# EAGLE schematic Schematic_v3_2 (EAGLE 9.6.2)
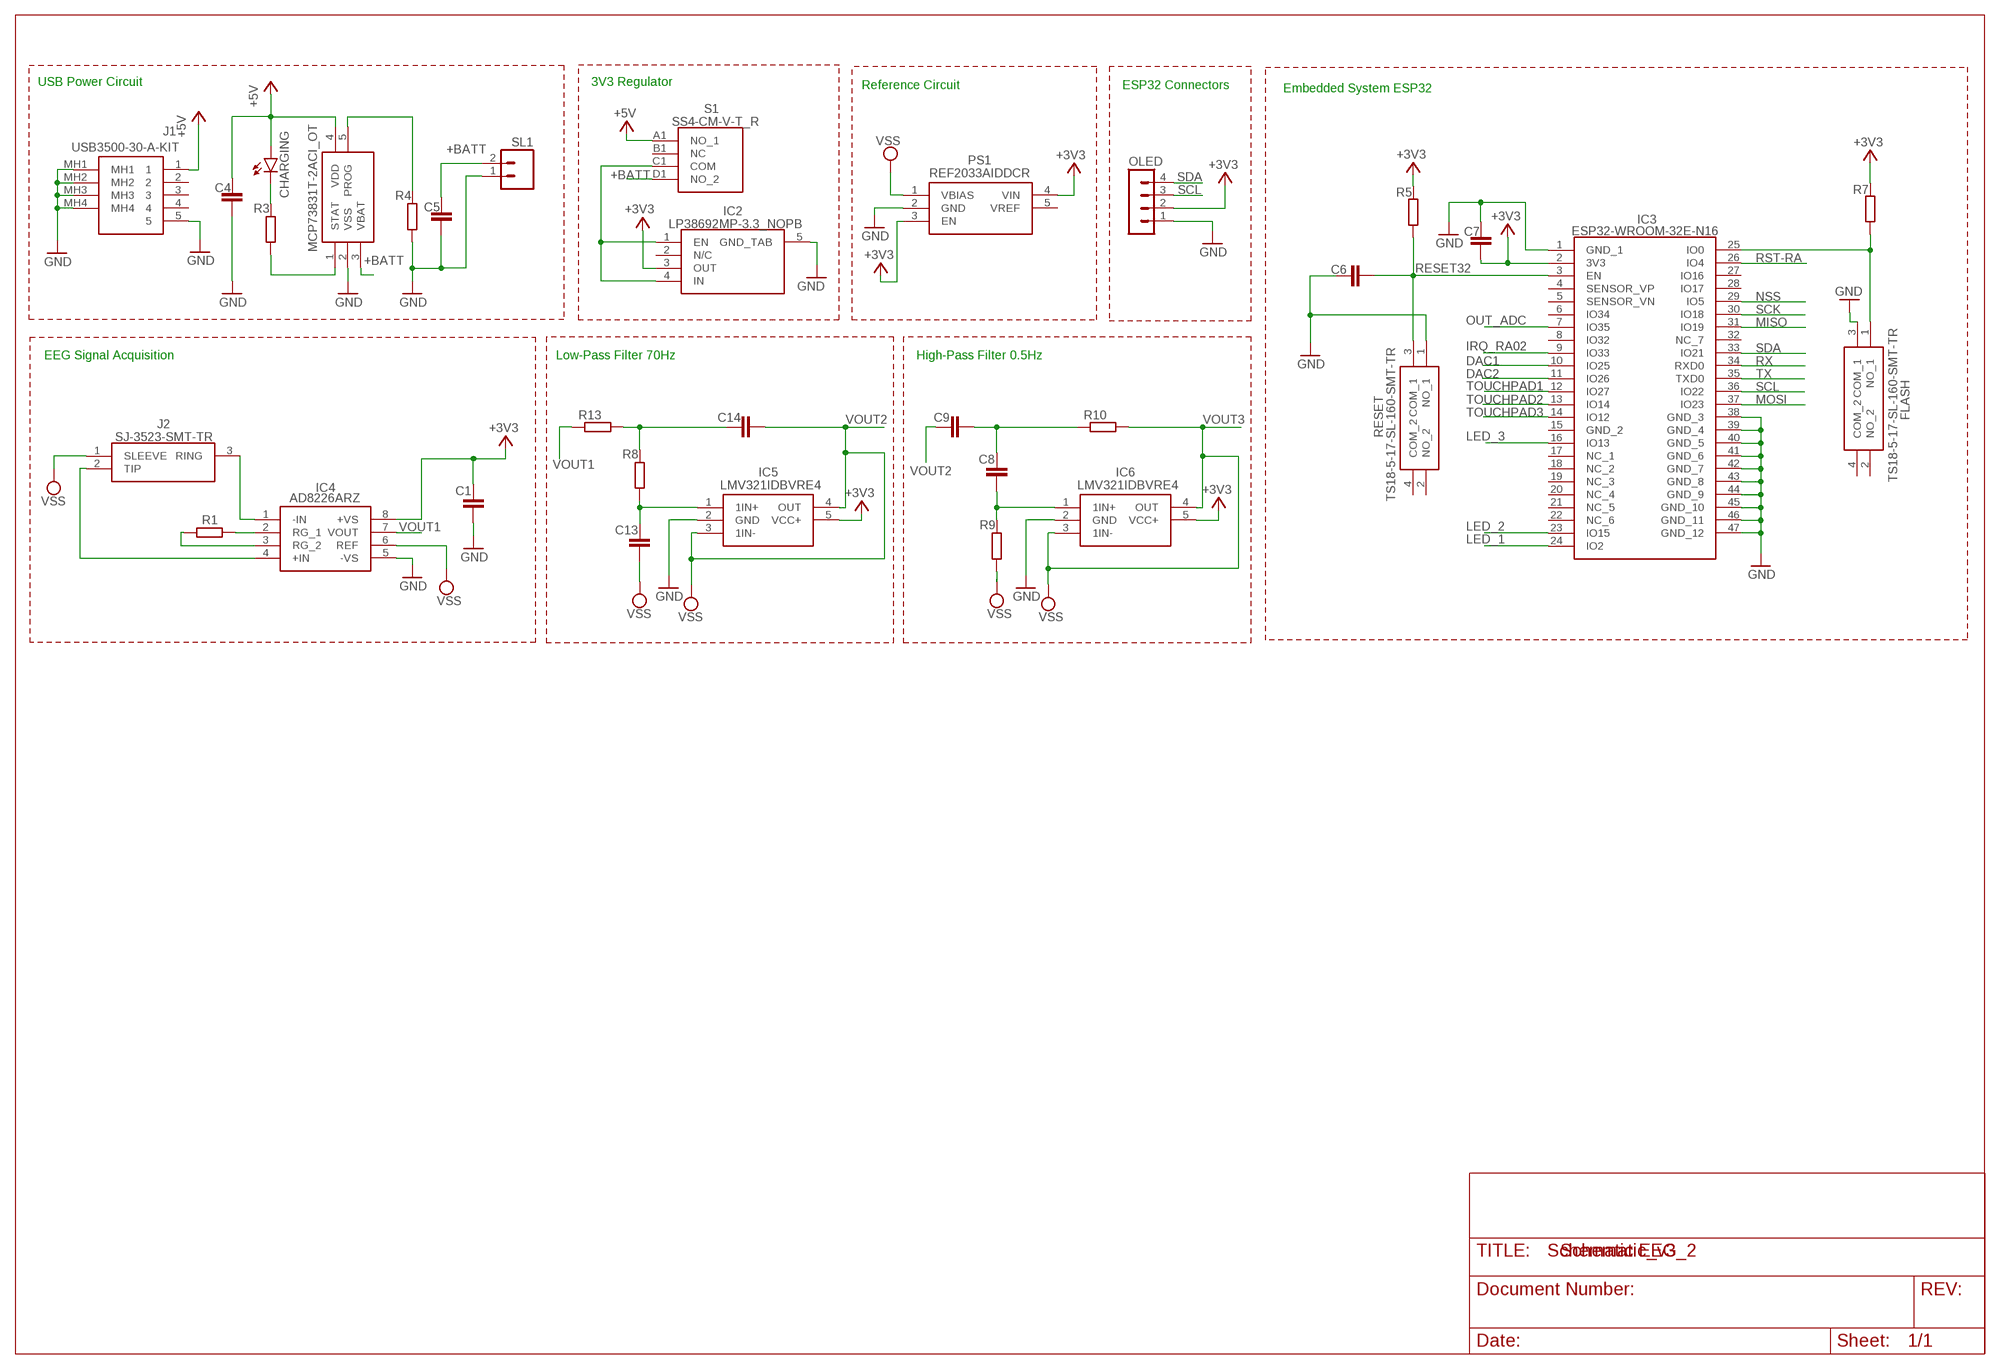
[diagram p0: schematic, sheet 1]

## Parts
C1  C-EUC0805  [C0805]
C4  C-EUC0805  [C0805]
C5  C-EUC0805  [C0805]
C6  C-EUC0805  [C0805]
C7  C-EUC0805  [C0805]
C8  C-EUC0805  [C0805]
C9  C-EUC0805  [C0805]
C13  C-EUC0805  [C0805]
C14  C-EUC0805  [C0805]
CHARGING  LEDCHIP-LED0805  [CHIP-LED0805]
FLASH  TS18-5-17-SL-160-SMT-TR  [TS18517SL160SMTTR]
IC1  MCP73831T-2ACI_OT  [SOT95P270X145-5N]
IC2  LP38692MP-3.3_NOPB  [SOT150P700X180-5N]
IC3  ESP32-WROOM-32E-N16  [ESP32WROOM32EN16]
IC4  AD8226ARZ  [SOIC127P600X175-8N]
IC5  LMV321IDBVRE4  [SOT95P280X145-5N]
IC6  LMV321IDBVRE4  [SOT95P280X145-5N]
J1  USB3500-30-A-KIT  [USB350030AKIT]
J2  SJ-3523-SMT-TR  [SJ3523SMTTR]
OLED  MA04-1  [MA04-1]
PS1  REF2033AIDDCR  [SOT95P280X110-5N]
R1  R-EU_R0805  [R0805]
R3  220  R-EU_R0805  [R0805]
R4  R-EU_R0805  [R0805]
R5  R-EU_R0805  [R0805]
R7  R-EU_R0805  [R0805]
R8  R-EU_R0805  [R0805]
R9  R-EU_R0805  [R0805]
R10  R-EU_R0805  [R0805]
R13  R-EU_R0805  [R0805]
RESET  TS18-5-17-SL-160-SMT-TR  [TS18517SL160SMTTR]
S1  SS4-CM-V-T_R  [SS4CMVTR]
SL1  M02  [02P]

## Nets
+3V3: C1.1 C7.2 IC2.3(OUT) IC3.2(3V3) IC4.8(+VS) IC5.5(VCC+) IC6.5(VCC+) OLED.2 PS1.3(EN) PS1.4(VIN) R5.2 R7.2
+5V: J1.1 S1.A1(NO_1)
+BATT: C5.2 IC1.3(VBAT) S1.D1(NO_2) SL1.2
DAC1: IC3.10(IO25)
DAC2: IC3.11(IO26)
GND: C1.2 C4.1 C5.1 C6.1 C7.1 FLASH.3(COM_1) IC1.2(VSS) IC2.5(GND_TAB) IC3.1(GND_1) IC3.38(GND_3) IC3.39(GND_4) IC3.40(GND_5) IC3.41(GND_6) IC3.42(GND_7) IC3.43(GND_8) IC3.44(GND_9) IC3.45(GND_10) IC3.46(GND_11) IC3.47(GND_12) IC4.5(-VS) IC5.2(GND) IC6.2(GND) J1.5 J1.MH1 J1.MH2 J1.MH3 J1.MH4 OLED.1 PS1.2(GND) R4.1 RESET.1(NO_1) SL1.1
IRQ_RA02: IC3.9(IO33)
LED_1: IC3.24(IO2)
LED_2: IC3.23(IO15)
LED_3: IC3.16(IO13)
MISO: IC3.31(IO19)
MOSI: IC3.37(IO23)
N$1: IC4.2(RG_1) R1.2
N$2: IC4.3(RG_2) R1.1
N$3: IC4.1(-IN) J2.3(RING)
N$4: IC4.4(+IN) J2.2(TIP)
N$5: C8.2 IC6.1(1IN+) R9.2
N$6: IC1.1(STAT) R3.1
N$7: IC1.5(PROG) R4.2
N$8: CHARGING.C R3.2
N$9: C8.1 C9.2 R10.1
N$10: FLASH.1(NO_1) IC3.25(IO0) R7.1
N$11: C13.1 IC5.1(1IN+) R8.1
N$13: IC2.1(EN) IC2.4(IN) S1.C1(COM)
N$15: C4.2 CHARGING.A IC1.4(VDD)
N$17: C14.1 R8.2 R13.2
NSS: IC3.29(IO5)
OUT_ADC: IC3.7(IO35)
RESET32: C6.2 IC3.3(EN) R5.1 RESET.3(COM_1)
RST-RA: IC3.26(IO4)
RX: IC3.34(RXD0)
SCK: IC3.30(IO18)
SCL: IC3.36(IO22) OLED.3
SDA: IC3.33(IO21) OLED.4
TOUCHPAD1: IC3.12(IO27)
TOUCHPAD2: IC3.13(IO14)
TOUCHPAD3: IC3.14(IO12)
TX: IC3.35(TXD0)
VOUT1: IC4.7(VOUT) R13.1
VOUT2: C9.1 C14.2 IC5.3(1IN-) IC5.4(OUT) ; supply symbol labelled VSS
VOUT3: IC6.3(1IN-) IC6.4(OUT) R10.2 ; supply symbol labelled VSS
VSS: C13.2 IC4.6(REF) J2.1(SLEEVE) PS1.1(VBIAS) R9.1
Unconnected: FLASH.2(NO_2) FLASH.4(COM_2) IC2.2(N/C) IC3.4(SENSOR_VP) IC3.5(SENSOR_VN) IC3.6(IO34) IC3.8(IO32) IC3.15(GND_2) IC3.17(NC_1) IC3.18(NC_2) IC3.19(NC_3) IC3.20(NC_4) IC3.21(NC_5) IC3.22(NC_6) IC3.27(IO16) IC3.28(IO17) IC3.32(NC_7) J1.2 J1.3 J1.4 PS1.5(VREF) RESET.2(NO_2) RESET.4(COM_2) S1.B1(NC)

## Notes on the sheet
- USB Power Circuit | 3V3 Regulator | Reference Circuit | ESP32 Connectors
- Embedded System ESP32
- EEG Signal Acquisition | Low-Pass Filter 70Hz | High-Pass Filter 0.5Hz
- Schematic EEG

## Library data of the parts
C1 C4-C9 C13 C14 = rcl:C-EU: CAPACITOR, European symbol; SPICEPREFIX: C
CHARGING = led:LED: LED OSRAM: - CHIPLED LG R971, LG N971, LY N971, LG Q971, LY Q971, LO R971, LY R971 LH N974, LH R974 LS Q976, LO Q976, LY Q976 LO Q996 - Hyper CHIPLED LW Q18S LB Q993, LB Q99A, LB R99A - SideLED LS A670, LO A670, LY A670, LG A670, LP A670 LB A673, LV A673, LT A673, LW A673 LH A674 LY A675 LS A676, LA A676, LO A676, LY A676, LW A676 LS A679, LY A679, LG A679 - Hyper Micro SIDELED® LS Y876, LA Y876, LO Y876, LY Y876 LT Y87S - SmartLED LW L88C, LW L88S LB L89C, LB L89S, LG L890 LS L89K, LO L89K, LY L89K LS L896, LA L896, LO L896, LY L896 - TOPLED LS T670, LO T670, LY T670, LG T670, LP T670 LSG T670, LSP T670, LSY T670, LOP T670, LYG T670 LG T671, LOG T671, LSG T671 LB T673, LV T673, LT T673, LW T673 LH T674 LS T676, LA T676, LO T676, LY T676, LB T676, LH T676, LSB T676, LW T676 LB T67C, LV T67C, LT T67C, LS T67K, LO T67K, LY T67K, LW E67C LS E67B, LA E67B, LO E67B, LY E67B, LB E67C, LV E67C, LT E67C LW T67C LS T679, LY T679, LG T679 LS T770, LO T770, LY T770, LG T770, LP T770 LB T773, LV T773, LT T773, LW T773 LH T774 LS E675, LA E675, LY E675, LS T675 LS T776, LA T776, LO T776, LY T776, LB T776 LHGB T686 LT T68C, LB T68C - Hyper Mini TOPLED® LB M676 - Mini TOPLED Santana® LG M470 LS M47K, LO M47K, LY M47K Source: http://www.osram.convergy.de LUXEON: - LUMILED® LXK2-PW12-R00, LXK2-PW12-S00, LXK2-PW14-U00, LXK2-PW14-V00 LXK2-PM12-R00, LXK2-PM12-S00, LXK2-PM14-U00 LXK2-PE12-Q00, LXK2-PE12-R00, LXK2-PE12-S00, LXK2-PE14-T00, LXK2-PE14-U00 LXK2-PB12-K00, LXK2-PB12-L00, LXK2-PB12-M00, LXK2-PB14-N00, LXK2-PB14-P00, LXK2-PB14-Q00 LXK2-PR12-L00, LXK2-PR12-M00, LXK2-PR14-Q00, LXK2-PR14-R00 LXK2-PD12-Q00, LXK2-PD12-R00, LXK2-PD12-S00 LXK2-PH12-R00, LXK2-PH12-S00 LXK2-PL12-P00, LXK2-PL12-Q00, LXK2-PL12-R00 Source: www.luxeon.com KINGBRIGHT: KA-3528ASYC Source: www.kingbright.com
FLASH RESET = TS18-5-17-SL-160-SMT-TR:TS18-5-17-SL-160-SMT-TR: 5 x 5 mm, 1.7 mm Actuator Height, 160 gf, Silver, Surface Mount, TR, SPST, Tactile Switch Source: Datasheet <https://www.sameskydevices.com/product/resource/supplyframepdf/ts18.pdf>; DESCRIPTION: 5 x 5 mm, 1.7 mm Actuator Height, 160 gf, Silver, Surface Mount, TR, SPST, Tactile Switch; HEIGHT: 1.8mm; MANUFACTURER_NAME: Same Sky; MANUFACTURER_PART_NUMBER: TS18-5-17-SL-160-SMT-TR; MOUSER_PART_NUMBER: 179-TS18517SL160SMTT; MOUSER_PRICE-STOCK: https://www.mouser.co.uk/ProductDetail/CUI-Devices/TS18-5-17-SL-160-SMT-TR?qs=tlsG%2FOw5FFhWy38y3t272A%3D%3D
IC1 = MCP73831T-2ACI_OT:MCP73831T-2ACI_OT: Li-Ion Charge Controller 4.2V SOT23-5 Source: Datasheet <http://ww1.microchip.com/downloads/en/DeviceDoc/20001984g.pdf>; ARROW_PART_NUMBER: MCP73831T-2ACI/OT; ARROW_PRICE-STOCK: https://www.arrow.com/en/products/mcp73831t-2aciot/microchip-technology?utm_currency=USD&region=nac; DESCRIPTION: Li-Ion Charge Controller 4.2V SOT23-5; HEIGHT: 1.45mm; MANUFACTURER_NAME: Microchip; MANUFACTURER_PART_NUMBER: MCP73831T-2ACI/OT; MOUSER_PART_NUMBER: 579-MCP73831T-2ACIOT; MOUSER_PRICE-STOCK: https://www.mouser.co.uk/ProductDetail/Microchip-Technology/MCP73831T-2ACI-OT?qs=yUQqVecv4qvbBQBGbHx0Mw%3D%3D
IC2 = LP38692MP-3.3_NOPB:LP38692MP-3.3_NOPB: LP38692MP-3.3/NOPB, Low Dropout Voltage Regulator, 1A, 3.3 V +/-2.5%, 2.7 10 Vin, 5-Pin SOT-223 Source: Datasheet <http://www.ti.com/lit/ds/symlink/lp38692.pdf>; DESCRIPTION: LP38692MP-3.3/NOPB, Low Dropout Voltage Regulator, 1A, 3.3 V +/-2.5%, 2.7 10 Vin, 5-Pin SOT-223; HEIGHT: 1.8mm; MANUFACTURER_NAME: Texas Instruments; MANUFACTURER_PART_NUMBER: LP38692MP-3.3/NOPB; MOUSER_PART_NUMBER: 926-LP38692MP3.3NOPB; MOUSER_PRICE-STOCK: https://www.mouser.co.uk/ProductDetail/Texas-Instruments/LP38692MP-3.3-NOPB?qs=1FNqv8aZn1TpKuOP2NKBdg%3D%3D
IC3 = ESP32-WROOM-32E-N16:ESP32-WROOM-32E-N16: Bluetooth, WiFi 802.11b/g/n, Bluetooth v4.2 +EDR, Class 1, 2 and 3 Transceiver Module 2.4GHz ~ 2.5GHz Integrated, Trace Surface Mount Source: Datasheet <https://www.espressif.com/sites/default/files/documentation/esp32-wroom-32e_esp32-wroom-32ue_datasheet_en.pdf>; DESCRIPTION: Bluetooth, WiFi 802.11b/g/n, Bluetooth v4.2 +EDR, Class 1, 2 and 3 Transceiver Module 2.4GHz ~ 2.5GHz Integrated, Trace Surface Mount; HEIGHT: 3.25mm; MANUFACTURER_NAME: Espressif Systems; MANUFACTURER_PART_NUMBER: ESP32-WROOM-32E-N16; MOUSER_PART_NUMBER: 356-ESP32WRM32E128PH; MOUSER_PRICE-STOCK: https://www.mouser.co.uk/ProductDetail/Espressif-Systems/ESP32-WROOM-32E-N16?qs=Li%252BoUPsLEnsC4cA%252BUYB2Bw%3D%3D
IC4 = AD8226ARZ:AD8226ARZ: Wide Supply Range, Rail-to-Rail Output Instrumentation Amplifier Source: Datasheet <http://componentsearchengine.com/Datasheets/3/AD8226ARZ.pdf>; DESCRIPTION: Wide Supply Range, Rail-to-Rail Output Instrumentation Amplifier; HEIGHT: 1.75mm; MANUFACTURER_NAME: Analog Devices; MANUFACTURER_PART_NUMBER: AD8226ARZ; MOUSER_PART_NUMBER: 584-AD8226ARZ; MOUSER_PRICE-STOCK: https://www.mouser.co.uk/ProductDetail/Analog-Devices/AD8226ARZ?qs=%2FtpEQrCGXCzihJADRPlhCg%3D%3D
IC5 IC6 = LMV321IDBVRE4:LMV321IDBVRE4: OP Amp Single GP R-R O/P 5.5V 5-Pin SOT-23 T/R Source: Datasheet <https://www.ti.com/lit/ds/symlink/lmv321.pdf?ts=1639294341048&ref_url=https%3A%2F%2Fwww.ti.com%2Fstore%2Fti%2Fen%2Fp%2Fproduct%2F%3Fp%3DLMV321IDBVR>; DESCRIPTION: OP Amp Single GP R-R O/P 5.5V 5-Pin SOT-23 T/R; HEIGHT: 1.45mm; MANUFACTURER_NAME: Texas Instruments; MANUFACTURER_PART_NUMBER: LMV321IDBVRE4; MOUSER_PART_NUMBER: 595-LMV321IDBVRE4; MOUSER_PRICE-STOCK: https://www.mouser.co.uk/ProductDetail/Texas-Instruments/LMV321IDBVRE4?qs=yhNIDeTE%252BcaI6cu5FHph6A%3D%3D
J1 = USB3500-30-A-KIT:USB3500-30-A-KIT: USB Connectors Micro B Skt, Mid Mount-SMT, R/A, 30u", With Peg, T&R, IP67 + USBTJ-02 Gasket Source: Datasheet <https://gct.co/files/drawings/usb3500.pdf>; DESCRIPTION: USB Connectors Micro B Skt, Mid Mount-SMT, R/A, 30u", With Peg, T&R, IP67 + USBTJ-02 Gasket; HEIGHT: 2.8mm; MANUFACTURER_NAME: GCT (GLOBAL CONNECTOR TECHNOLOGY); MANUFACTURER_PART_NUMBER: USB3500-30-A-KIT; MOUSER_PART_NUMBER: 640-USB3500-30-A-KIT; MOUSER_PRICE-STOCK: https://www.mouser.co.uk/ProductDetail/GCT/USB3500-30-A-KIT?qs=KUoIvG%2F9IlZmD2kH2DfgYg%3D%3D
J2 = SJ-3523-SMT-TR:SJ-3523-SMT-TR: 3.5 mm, Stereo, Right Angle, Surface Mount (SMT), 3 Conductors, 0 Internal Switches, Audio Jack Connector Source: Datasheet <https://www.sameskydevices.com/product/resource/supplyframepdf/sj-352x-smt.pdf>; DESCRIPTION: 3.5 mm, Stereo, Right Angle, Surface Mount (SMT), 3 Conductors, 0 Internal Switches, Audio Jack Connector; HEIGHT: 5.2mm; MANUFACTURER_NAME: Same Sky; MANUFACTURER_PART_NUMBER: SJ-3523-SMT-TR; MOUSER_PART_NUMBER: 490-SJ-3523-SMT-TR; MOUSER_PRICE-STOCK: https://www.mouser.co.uk/ProductDetail/CUI-Devices/SJ-3523-SMT-TR?qs=WyjlAZoYn51zOHzJ3r4ZRA%3D%3D
OLED = con-lstb:MA04-1: PIN HEADER; OC_FARNELL: unknown; OC_NEWARK: unknown
PS1 = REF2033AIDDCR:REF2033AIDDCR: Low-Drift, Low-Power, Dual-Output Vref and Vref/2 Voltage Reference Source: Datasheet <http://www.ti.com/lit/ds/symlink/ref2033.pdf>; DESCRIPTION: Low-Drift, Low-Power, Dual-Output Vref and Vref/2 Voltage Reference; HEIGHT: 1.1mm; MANUFACTURER_NAME: Texas Instruments; MANUFACTURER_PART_NUMBER: REF2033AIDDCR; MOUSER_PART_NUMBER: 595-REF2033AIDDCR; MOUSER_PRICE-STOCK: https://www.mouser.co.uk/ProductDetail/Texas-Instruments/REF2033AIDDCR?qs=7z%252BmIopC6%2FKHHOBVNaL7UQ%3D%3D
R1 R3-R5 R7-R10 R13 = rcl:R-EU_: RESISTOR, European symbol; SPICEPREFIX: R
S1 = SS4-CM-V-T_R:SS4-CM-V-T_R: Slide Switches Slide Type 1P3T (2.0mm height) Source: Datasheet <https://componentsearchengine.com/Datasheets/1/SS4-CM-V-T_R.pdf>; DESCRIPTION: Slide Switches Slide Type 1P3T (2.0mm height); HEIGHT: 2mm; MANUFACTURER_NAME: Diptronics; MANUFACTURER_PART_NUMBER: SS4-CM-V-T/R; MOUSER_PART_NUMBER: 113-SS4CMVTR; MOUSER_PRICE-STOCK: https://www.mouser.co.uk/ProductDetail/Diptronics/SS4-CM-V-T-R?qs=MLItCLRbWswqNEU%2F6grMKg%3D%3D
SL1 = con-amp-quick:M02: AMP QUICK CONNECTOR; OC_FARNELL: unknown; OC_NEWARK: unknown